# Altium schematic sheet Battery_Interface.SchDoc
size A4; SheetNumber: 3; SheetTotal: 3
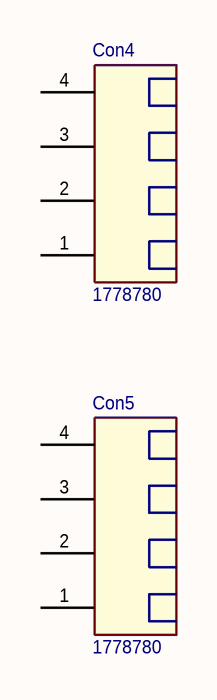
[diagram p0: Battery_Interface.SchDoc]

## Parts
Con4  1778780  [term_block_1row_4pin_phoenix_smd_2.5mm_90deg_1778780]
Con5  1778780  [term_block_1row_4pin_phoenix_smd_2.5mm_90deg_1778780]

## Nets

Not connected (* = marked no-connect by the designer): Con4 1 2 3 4; Con5 1 2 3 4

## Library data of the parts
Con4 Con5 = 1778780: TERM BLOCK HDR 4POS 90DEG 2.5MM; Manufacturer: Phoenix Contact; Manufacturer Standard Lead Time: 4 Weeks; ID: 7; Created_By: PG; Detailed Description: 4 Position Terminal Block Header, Male Pins, Shrouded (4 Side) 0.098" (2.50mm) 90°, Right Angle - Surface Mount; Number of Positions: 4; Material Flammability Rating: UL94 V-0; Voltage - IEC: 160 V; Number of Levels: 1; Pitch: 0.098" (2.50mm); Header Orientation: 90°, Right Angle; Current - IEC: 6A; Part Number: 1778780; Created_Date: 2020-10-30 15:08:21.525401; LifeCycle: yes; Digikey_URL: https://www.digikey.com/en/products/detail/phoenix-contact/1778780/2625551; Manufacturer Part Number: 1778780; ComponentLink1Description: 1778780; ComponentLink1URL: //media.digikey.com/PDF/Data%20Sheets/Phoenix%20Contact%20PDFs/1778780.pdf; Series: COMBICON PTSM; Part Status: Active; Mounting Type: Surface Mount; Insulation Height: 0.197" (5.00mm); Operating Temperature: -; Ingress Protection: -; Features: Board Guide, Pick and Place Cap, Solder Retention; Contact Material: -; Supplier 1: Digikey; Supplier Part Number 1: 277-2317-2-ND; Supplier: Phoenix Contact; Moisture Sensitivity Level (MSL): 1  (Unlimited); Digi-Key Part Number Cut Tape (CT): 277-2317-1-ND; RoHS Status: RoHS Compliant; Digi-Key Part Number Tape & Reel (TR): 277-2317-2-ND; Digi-Key Part Number Digi-Reel®: 277-2317-6-ND; Termination Style: Solder; Wire Gauge or Range - mm²: -; Wire Gauge or Range - AWG: -; Plug Wire Entry: -; Housing Material: Liquid Crystal Polymer (LCP); Color: Black; Type: Header, Male Pins, Shrouded (4 Side); Screw Size: -; Wire Strip Length: -; Contact Mating Finish: Tin; Contact Tail Length: -; Torque - Screw: -; Positions Per Level: 4